# Altium schematic sheet PowerSupply.SchDoc
size A4
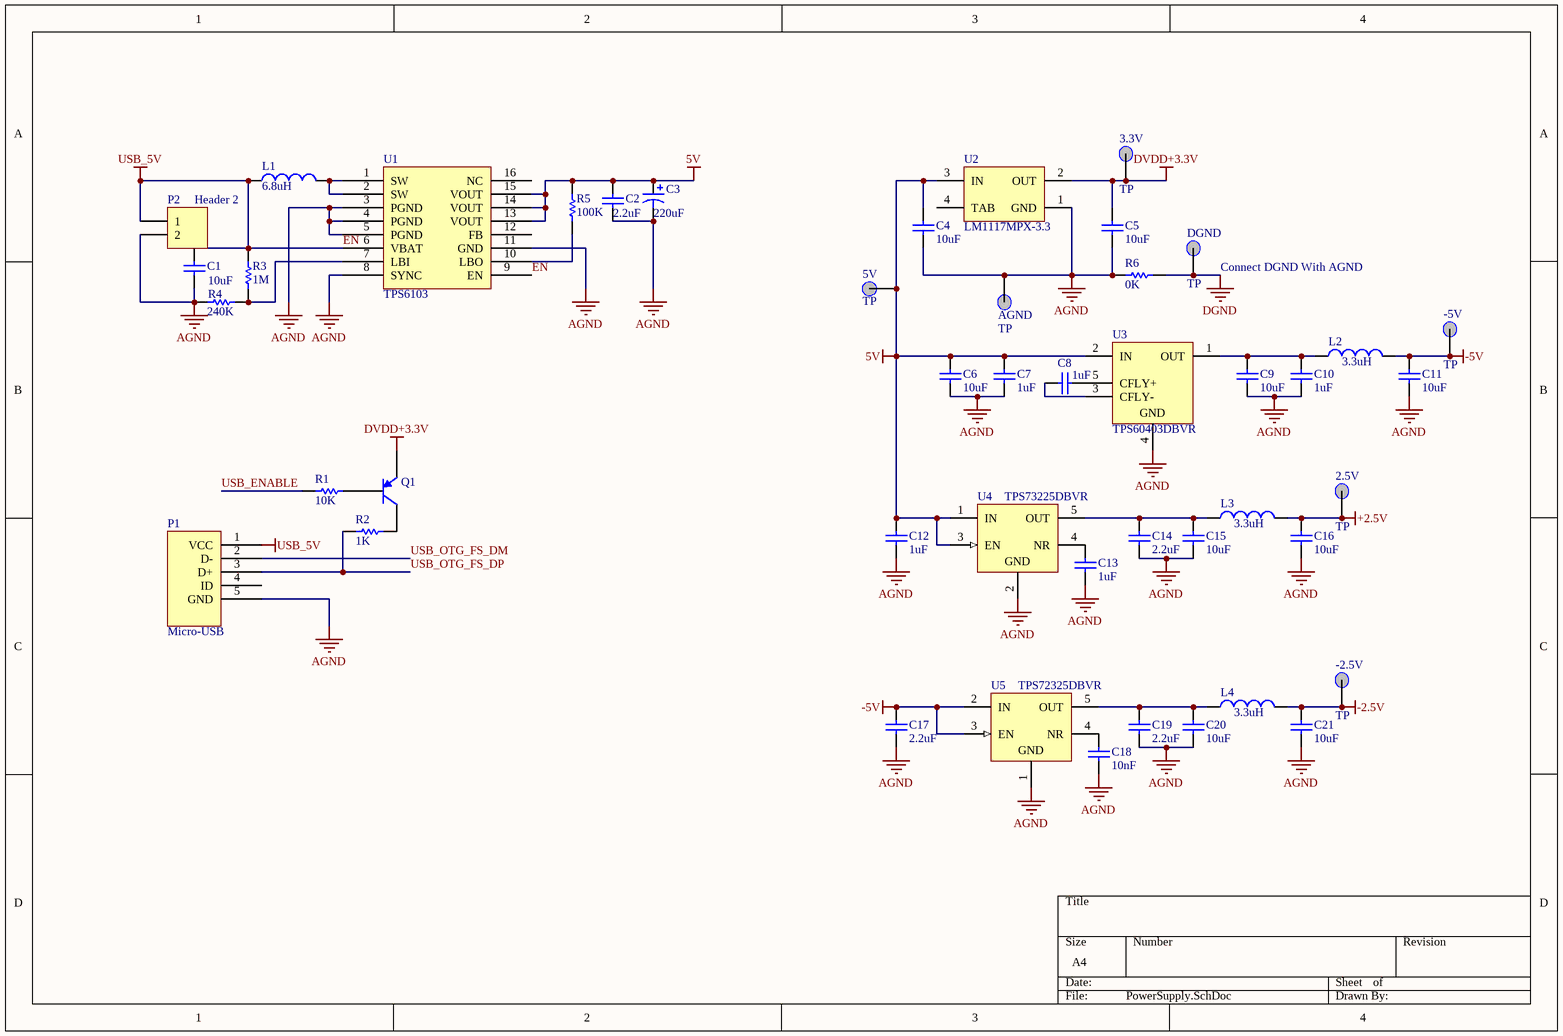
[diagram p0: PowerSupply.SchDoc]

## Parts
2.5V  TP  [TestPort]
3.3V  TP  [TestPort]
5V  TP  [TestPort]
-2.5V  TP  [TestPort]
-5V  TP  [TestPort]
AGND  TP  [TestPort]
C1  10uF  [1608[0603]]
C2  2.2uF  [1608[0603]]
C3  220uF  [6TPF220M5L]
C4  10uF  [1608[0603]]
C5  10uF  [1608[0603]]
C6  10uF  [1608[0603]]
C7  1uF  [1608[0603]]
C8  1uF  [1608[0603]]
C9  10uF  [1608[0603]]
C10  1uF  [1608[0603]]
C11  10uF  [1608[0603]]
C12  1uF  [1608[0603]]
C13  1uF  [1608[0603]]
C14  2.2uF  [1608[0603]]
C15  10uF  [1608[0603]]
C16  10uF  [1608[0603]]
C17  2.2uF  [1608[0603]]
C18  10nF  [1608[0603]]
C19  2.2uF  [1608[0603]]
C20  10uF  [1608[0603]]
C21  10uF  [1608[0603]]
DGND  TP  [TestPort]
L1  6.8uH  [B82464G4682M]
L2  3.3uH  [2029]
L3  3.3uH  [2029]
L4  3.3uH  [2029]
P1  Micro-USB  [Micro-USB]
P2  Header 2  [HDR1X2]
Q1  PNP  [SOT-23B_N]  (value not drawn)
R1  10K  [J1-0603]
R2  1K  [J1-0603]
R3  1M  [J1-0603]
R4  240K  [J1-0603]
R5  100K  [J1-0603]
R6  0K  [J1-0603]
U1  TPS6103  [TI_PWP_G16]
U2  LM1117MPX-3.3  [MP04A_N]
U3  TPS60403DBVR  [TI-DBV5_N]
U4  TPS73225DBVR  [TI-DBV5_N]
U5  TPS72325DBVR  [TI-DBV5_N]

## Nets
5V: 5V.0 C2.2 C3.1 C4.1 C6.2 C7.2 C12.2 R5.2 U1.13(VOUT) U1.14(VOUT) U1.15(VOUT) U2.3(IN) U3.2(IN) U4.1(IN) U4.3(EN)
+2.5V: 2.5V.0 C16.2 L3.2
-2.5V: -2.5V.0 C21.2 L4.2
-5V: -5V.0 C11.2 C17.2 L2.2 U5.2(IN) U5.3(EN)
AGND: AGND.0 C1.1 C2.1 C3.2 C4.2 C5.2 C6.1 C7.1 C9.1 C10.1 C11.1 C12.1 C13.1 C14.1 C15.1 C16.1 C17.1 C18.1 C19.1 C20.1 C21.1 P1.5(GND) P2.2 R4.1 R6.1 U1.3(PGND) U1.4(PGND) U1.5(PGND) U1.8(SYNC) U1.11(GND) U2.1(GND) U3.4(GND) U4.2(GND) U5.1(GND)
DGND: DGND.0 R6.2
DVDD+3.3V: 3.3V.0 C5.1 Q1.3(E) U2.2(OUT)
EN: C1.2 L1.1 P1.1(VCC) P2.1 R3.2 U1.6(VBAT) U1.9(EN)  [also labelled USB_5V]
USB_ENABLE: R1.1
USB_OTG_FS_DM: P1.2(D-)
USB_OTG_FS_DP: P1.3(D+) R2.2
NetC8_1: C8.1 U3.3(CFLY-)
NetC8_2: C8.2 U3.5(CFLY+)
NetC9_2: C9.2 C10.2 L2.1 U3.1(OUT)
NetC13_2: C13.2 U4.4(NR)
NetC14_2: C14.2 C15.2 L3.1 U4.5(OUT)
NetC18_2: C18.2 U5.4(NR)
NetC19_2: C19.2 C20.2 L4.1 U5.5(OUT)
NetL1_2: L1.2 U1.1(SW) U1.2(SW)
NetQ1_1: Q1.1(C) R2.1
NetQ1_2: Q1.2(B) R1.2
NetR3_1: R3.1 R4.2 U1.7(LBI)
NetR5_1: R5.1 U1.10(LBO)

Not connected (* = marked no-connect by the designer): P1 4(ID); U1 12(FB) 16(NC); U2 4(TAB)

## Notes on the sheet
- (near DGND) Connect DGND With AGND

## Library data of the parts
2.5V 3.3V 5V -2.5V -5V AGND DGND = TestPoint
C1 C2 C4-C21 = Cap: Capacitor; Published: 8-Jun-2000; LatestRevisionDate: 17-Jul-2002; LatestRevisionNote: Re-released for DXP Platform.; PackageReference: RAD-0.3; Publisher: Altium Limited; PackageDescription: Radial Cap, Thru-Hole; 2 Leads; 0.3 in Pin Spacing
  C1 C4-C6 C9 C11 C15 C16 C20 C21: Value: 10uF
  C2 C14 C17 C19: Value: 2.2uF
  C7 C8 C10 C12 C13: Value: 1uF
  C18: Value: 10nF
C3 = Cap Pol1: Polarized Capacitor (Radial); Published: 8-Jun-2000; LatestRevisionDate: 17-Jul-2002; LatestRevisionNote: Re-released for DXP Platform.; PackageReference: RB7.6-15; Publisher: Altium Limited; PackageDescription: Polarized Capacitor (Radial); 2 Leads; Value: 220uF
L1-L4 = Inductor: Code_IEC: 1005; Published: 8-Jun-2000; LatestRevisionDate: 29-May-2009; LatestRevisionNote: IPC-7351 Footprint Added.; PackageReference: 0402-A; Publisher: Altium Limited; PackageDescription: Chip Inductor; Code_JEITA: 0402
  L1: Value: 6.8uH
  L2-L4: Value: 3.3uH
P2 = Header 2: Header, 2-Pin; LatestRevisionDate: 17-Jul-2002; LatestRevisionNote: Re-released for DXP Platform.; Publisher: Altium Limited
Q1 = PNP: PNP Bipolar Transistor; Published: 8-Jun-2000; LatestRevisionDate: 29-May-2009; LatestRevisionNote: IPC-7351 Footprint Added.; PackageVersion: Aug-1999; PackageReference: SOT-23B; Publisher: Altium Limited; PackageDescription: 3-Pin SOT-23 Package 0.95 mm Pitch, 2.4 mm Lead Span
R1-R6 = Res1: Resistor; Published: 8-Jun-2000; LatestRevisionDate: 17-Jul-2002; LatestRevisionNote: Re-released for DXP Platform.; PackageReference: AXIAL-0.3; Publisher: Altium Limited; PackageDescription: Axial Device, Thru-Hole; 2 Leads; 0.3 in Pin Spacing
  R1: Value: 10K
  R2: Value: 1K
  R3: Value: 1M
  R4: Value: 240K
  R5: Value: 100K
  R6: Value: 0K
U2 = LM1117MPX-3.3: 800mA Low-Dropout Linear Regulator, 4-pin SOT-223; Manufacturer: National Semiconductor; PackageTopMarking: XYTT*N05A; PowerWise: N; CompType: LDO IC; Published: 1-Mar-2010; DatasheetVersion: Apr-2006; PackageVersion: revB, Apr-2003; PackageReference: MP04A; Publisher: Altium Limited; PackageDescription: Molded SOT-223, 6.50 x 3.56 x 1.6mm Body, 4 Lead, 2.3mm Pitch; Supplier 1: Farnell; Supplier Part Number 1: 1652313; PartNumber: LM1117MPX-3.3; RoHS: N; PinCount: 4; Code_JEDEC: TO-261-AA; Code_IPC: SOT223-4; ComponentLink1Description: LM1117 Datasheet; ComponentLink1URL: http://www.national.com/ds/LM/LM1117.pdf; ComponentLink2Description: LM1117 Web Page; ComponentLink2URL: http://www.national.com/pf/LM/LM1117.html; ComponentLink3Description: MP04A Package Page; ComponentLink3URL: http://www.national.com/packaging/folders/mp04a.html
U3 = TPS60403DBVR: -1.8 to -5.25 V, Inverting Charge Pump Regulator, 60 mA, 1.8 to 5.25 V Input with 2-Cell Alkaline / Nixx Input, -40 to 85 degC, 5-pin SOT23 (DBV5), Green (RoHS & no Sb/Br); Manufacturer: Texas Instruments; 2-Cell Alkaline/Nixx Input: TRUE; Efficiency(Typ)(%): 99; Iout(Max)(A): 0.06; Iq(Typ)(mA): 0.425; Switching Frequency(Max)(kHz): 300; Topology: Inverting Buck/Boost; Vin(Max)(V): 5.25; Vin(Min)(V): 1.8; DatasheetVersion: SLVS324A; PackageVersion: 4073253-4/K; PackageReference: DBV5; PackageDescription: 5-Pin Plastic Small Outline, Body 1.60 脳 2.90 mm, Pitch 0.95 mm; Supplier 1: Digi-Key; Supplier Part Number 1: 296-27005-2-ND; Supplier 2: Digi-Key; Supplier Part Number 2: 296-27005-1-ND; Supplier 3: Digi-Key; Supplier Part Number 3: 296-27005-6-ND; Supplier 4: Newark; Supplier Part Number 4: 77C0631; Supplier 5: Mouser; Supplier Part Number 5: 595-TPS60403DBVR; Eco-Plan: Green (RoHS & no Sb/Br); Vout(Max)(V): -5.25; Vout(Min)(V): -1.8; Mounting Technology: Surface Mount; Code_JEDEC: MO-178; PartNumber: TPS60403DBVR; ComponentLink1Description: Manufacturer URL; ComponentLink1URL: http://www.ti.com/; ComponentLink2Description: Datasheet; ComponentLink2URL: http://www.ti.com/general/docs/lit/getliterature.tsp?genericPartNumber=TPS60403&fileType=pdf; ComponentLink3Description: Package Specification; ComponentLink3URL: http://www.ti.com/litv/pdf/mpds018i
U4 = TPS73225DBVR: Single Output Fast Transient Response LDO, 250 mA, Fixed 2.5 V Output, 1.7 to 5.5 V Input, with Reverse Current Protection, 5-pin SOT-23 (DBV), -40 to 85 degC, Green (RoHS & no Sb/Br); Manufacturer: Texas Instruments; Accuracy(%): 1; Fixed Output Options(V): 2.5; Iout(Max)(A): 0.25; Iq(Typ)(mA): 0.4; SubFamily: Single Channel LDO; Vdo(Typ)(mV): 40; Vin(Max)(V): 5.5; Vin(Min)(V): 1.7; DatasheetVersion: SBVS037O; PackageVersion: 4073253-4/K; PackageReference: DBV5; PackageDescription: 5-Pin Plastic Small Outline, Body 1.60 脳 2.90 mm, Pitch 0.95 mm; Supplier 1: Digi-Key; Supplier Part Number 1: TPS73225DBVR-ND; Supplier 2: Newark; Supplier Part Number 2: 87H2963; Supplier 3: Mouser; Supplier Part Number 3: 595-TPS73225DBVR; Eco-Plan: Green (RoHS & no Sb/Br); Vout Adj(Max)(V): 2.5; Vout Adj(Min)(V): 2.5; Mounting Technology: Surface Mount; Code_JEDEC: MO-178; PartNumber: TPS73225DBVR; ComponentLink1Description: Manufacturer URL; ComponentLink1URL: http://www.ti.com/; ComponentLink2Description: Datasheet; ComponentLink2URL: http://www.ti.com/general/docs/lit/getliterature.tsp?genericPartNumber=TPS73225&fileType=pdf; ComponentLink3Description: Package Specification; ComponentLink3URL: http://www.ti.com/litv/pdf/mpds018i
U5 = TPS72325DBVR: Single Output High PSRR LDO, 200 mA, Fixed -2.5 V Output, -10 to -2.7 V Input, 5-pin SOT-23 (DBV), -40 to 125 degC, Green (RoHS & no Sb/Br); Manufacturer: Texas Instruments; Accuracy(%): 2; Iout(Max)(A): 0.2; Iq(Typ)(mA): 0.13; SubFamily: Single Channel LDO; Vdo(Typ)(mV): 280; DatasheetVersion: SLVS346B; PackageVersion: 4073253-4/K; PackageReference: DBV5; PackageDescription: 5-Pin Plastic Small Outline, Body 1.60 脳 2.90 mm, Pitch 0.95 mm; Supplier 1: Digi-Key; Supplier Part Number 1: TPS72325DBVR-ND; Supplier 2: Newark; Supplier Part Number 2: 87H2932; Supplier 3: Mouser; Supplier Part Number 3: 595-TPS72325DBVR; Eco-Plan: Green (RoHS & no Sb/Br); Fixed Output Options(V): -2.5; Vin(Max)(V): -2.7; Vin(Min)(V): -10; Vout Adj(Max)(V): -2.5; Vout Adj(Min)(V): -2.5; Mounting Technology: Surface Mount; Code_JEDEC: MO-178; PartNumber: TPS72325DBVR; ComponentLink1Description: Manufacturer URL; ComponentLink1URL: http://www.ti.com/; ComponentLink2Description: Datasheet; ComponentLink2URL: http://www.ti.com/general/docs/lit/getliterature.tsp?genericPartNumber=TPS72325&fileType=pdf; ComponentLink3Description: Package Specification; ComponentLink3URL: http://www.ti.com/litv/pdf/mpds018i